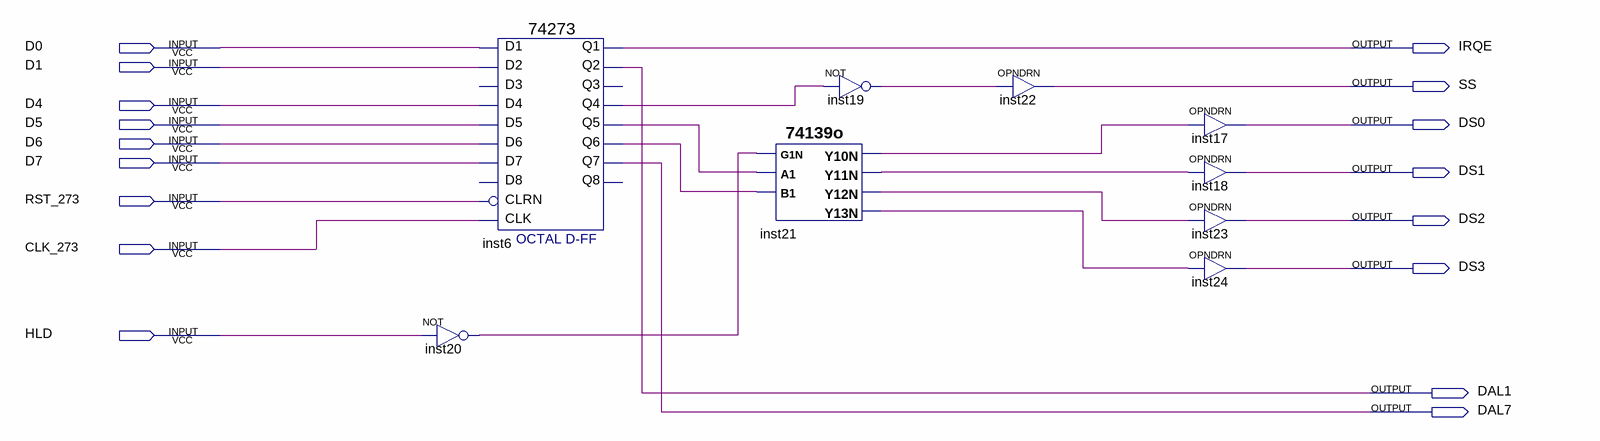
[diagram p0: schematic sheet]
// Quartus schematic Reg_273.bdf as structural Verilog: 9 symbols, 17 pins
module Reg_273 (
  input  D0,
  input  D1,
  input  D4,
  input  D5,
  input  D6,
  input  D7,
  input  RST_273,
  input  CLK_273,
  input  HLD,
  output IRQE,
  output SS,
  output DS0,
  output DS1,
  output DS2,
  output DS3,
  output DAL1,
  output DAL7
);

  wire inst6_q4, inst6_q5, inst6_q6, inst19_out, inst20_out, inst21_y10n, inst21_y11n, inst21_y12n,
       inst21_y13n;

  not inst20 (inst20_out, HLD);
  \74273  inst6 (
    .D2(D1), .D1(D0), .D4(D4), .D7(D7), .D6(D6), .D5(D5), .CLK(CLK_273), .CLRN(RST_273), .Q4(inst6_q4),
    .Q1(IRQE), .Q2(DAL1), .Q6(inst6_q6), .Q5(inst6_q5), .Q7(DAL7));  // open: D3, D8, Q3, Q8
  \74139o  inst21 (
    .G1N(inst20_out), .A1(inst6_q5), .B1(inst6_q6), .Y10N(inst21_y10n), .Y11N(inst21_y11n),
    .Y12N(inst21_y12n), .Y13N(inst21_y13n));
  not inst19 (inst19_out, inst6_q4);
  OPNDRN inst22 (.IN(inst19_out), .OUT(SS));
  OPNDRN inst17 (.IN(inst21_y10n), .OUT(DS0));
  OPNDRN inst18 (.IN(inst21_y11n), .OUT(DS1));
  OPNDRN inst23 (.IN(inst21_y12n), .OUT(DS2));
  OPNDRN inst24 (.IN(inst21_y13n), .OUT(DS3));
endmodule
